# EAGLE design LED controller (EAGLE 8.2.1)
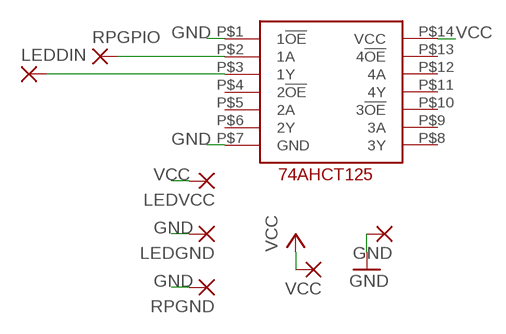
[diagram p0: schematic, sheet 1]

## Parts
GND  1,6/0,9  [1,6/0,9]
LEDDIN  1,6/0,9  [1,6/0,9]
LEDGND  1,6/0,9  [1,6/0,9]
LEDVCC  1,6/0,9  [1,6/0,9]
RPGND  1,6/0,9  [1,6/0,9]
RPGPIO  1,6/0,9  [1,6/0,9]
U$1  74AHCT125N14  [N14]
VCC  1,6/0,9  [1,6/0,9]

## Nets
GND: GND.1(P) LEDGND.1(P) RPGND.1(P) U$1.P$1(1!OE!) U$1.P$7(GND)
N$1: RPGPIO.1(P) U$1.P$2(1A)
N$2: LEDDIN.1(P) U$1.P$3(1Y)
VCC: LEDVCC.1(P) U$1.P$14(VCC) VCC.1(P)
Unconnected: U$1.P$4(2!OE!) U$1.P$5(2A) U$1.P$6(2Y) U$1.P$8(3Y) U$1.P$9(3A) U$1.P$10(3!OE!) U$1.P$11(4Y) U$1.P$12(4A) U$1.P$13(4!OE!)

## Library data of the parts
GND LEDDIN LEDGND LEDVCC RPGND RPGPIO VCC = wirepad:1,6/0,9: THROUGH-HOLE PAD
U$1 = customs:74AHCT125

## Board
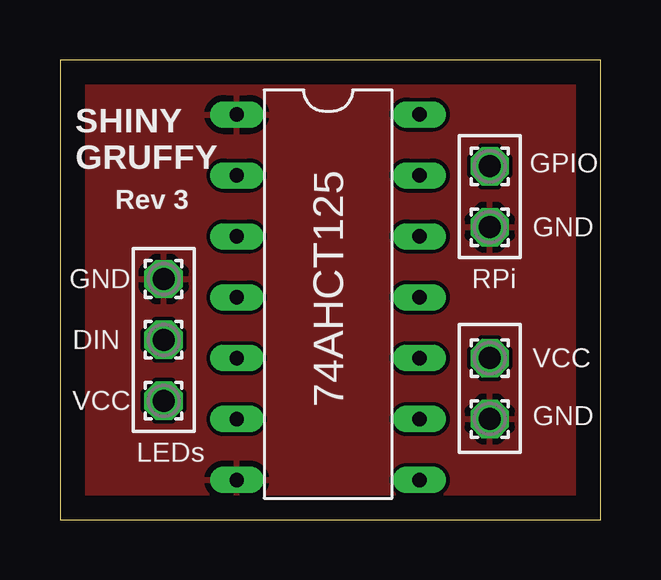
[diagram p1: board, top side]
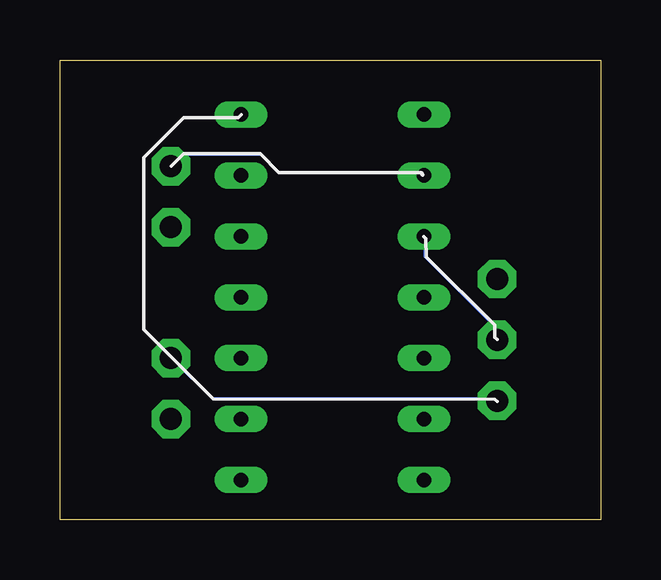
[diagram p2: board, bottom side, seen from below]

Size 22.53 x 19.17 mm. Coordinates in mm from the lower left corner, seen from the top.
Outline: 0,0 22.53,0 22.53,19.17 0,19.17 0,0
Copper layers (1*16): Top 0.035mm / dielectric 1.5mm / Bottom 0.035mm
Design rules "default": minimum track width 6mil, minimum drill 0.35mm, track to track 6mil, track to pad 6mil, pad to pad 6mil, via to via 6mil, smd to smd 6mil, copper to edge 40mil, drill to drill 6mil, minimum pad ring 10mil, minimum via ring 8mil, stop-mask expansion 4mil, vias tented up to drill 0mil, thermal gap 10mil

### Footprints (pad centres in the part's own frame; a part is rotated, then mirrored left to right if it is on the bottom)
1,6/0,9 = drill 0.914 pad 1.6 octagon: 1 0,0
N14 = drill 0.6 long: P$1 0,0; P$2 0,-2.54; P$3 0,-5.08; P$4 0,-7.62; P$5 0,-10.16; P$6 0,-12.7; P$7 0,-15.24; P$8 7.62,-15.24; P$9 7.62,-12.7; P$10 7.62,-10.16; P$11 7.62,-7.62; P$12 7.62,-5.08; P$13 7.62,-2.54; P$14 7.62,0

### Placement (x,y rotation side)
GND  17.91,4.19 0 top
LEDDIN  4.32,7.49 0 top
LEDGND  4.32,10.03 0 top
LEDVCC  4.32,4.95 0 top
RPGND  17.91,12.19 0 top
RPGPIO  17.91,14.73 0 top
U$1  7.37,16.89 0 top
VCC  17.91,6.73 0 top

### Tracks (layer width: path | path; a pad name or v marks a point on that pad's centre or on a via)
GND
  pour Top: 0.2,19 22.4,19 22.4,0.2 0.2,0.2
N$1
  Bottom 0.152: U$1.P$2 7.47,14.48 13.41,14.48 14.17,15.24 17.37,15.24 17.83,14.78 RPGPIO.1
N$2
  Bottom 0.152: U$1.P$3 7.32,11.73 7.32,10.97 4.42,8.08 4.42,7.62 LEDDIN.1
VCC
  Bottom 0.152: U$1.P$14 15.09,16.76 17.37,16.76 19.05,15.09 19.05,7.92 17.98,6.86 VCC.1 17.83,6.71 16.15,5.03 4.42,5.03 LEDVCC.1

### Text on the board
tPlace: SHINY / GRUFFY | GPIO | Rev 3 | GND | GND | RPi | DIN | VCC | VCC | GND | LEDs